# Altium schematic sheet logic_main.SchDoc: mcHF Pro Transceiver UI board
size A3; Author: Krassi Atanassov; CompanyName: MØNKA; Engineer: For radio amateurs experimentation, non-commercial use only. Thank you!; Revision: 0.8.2; SheetTotal: 18
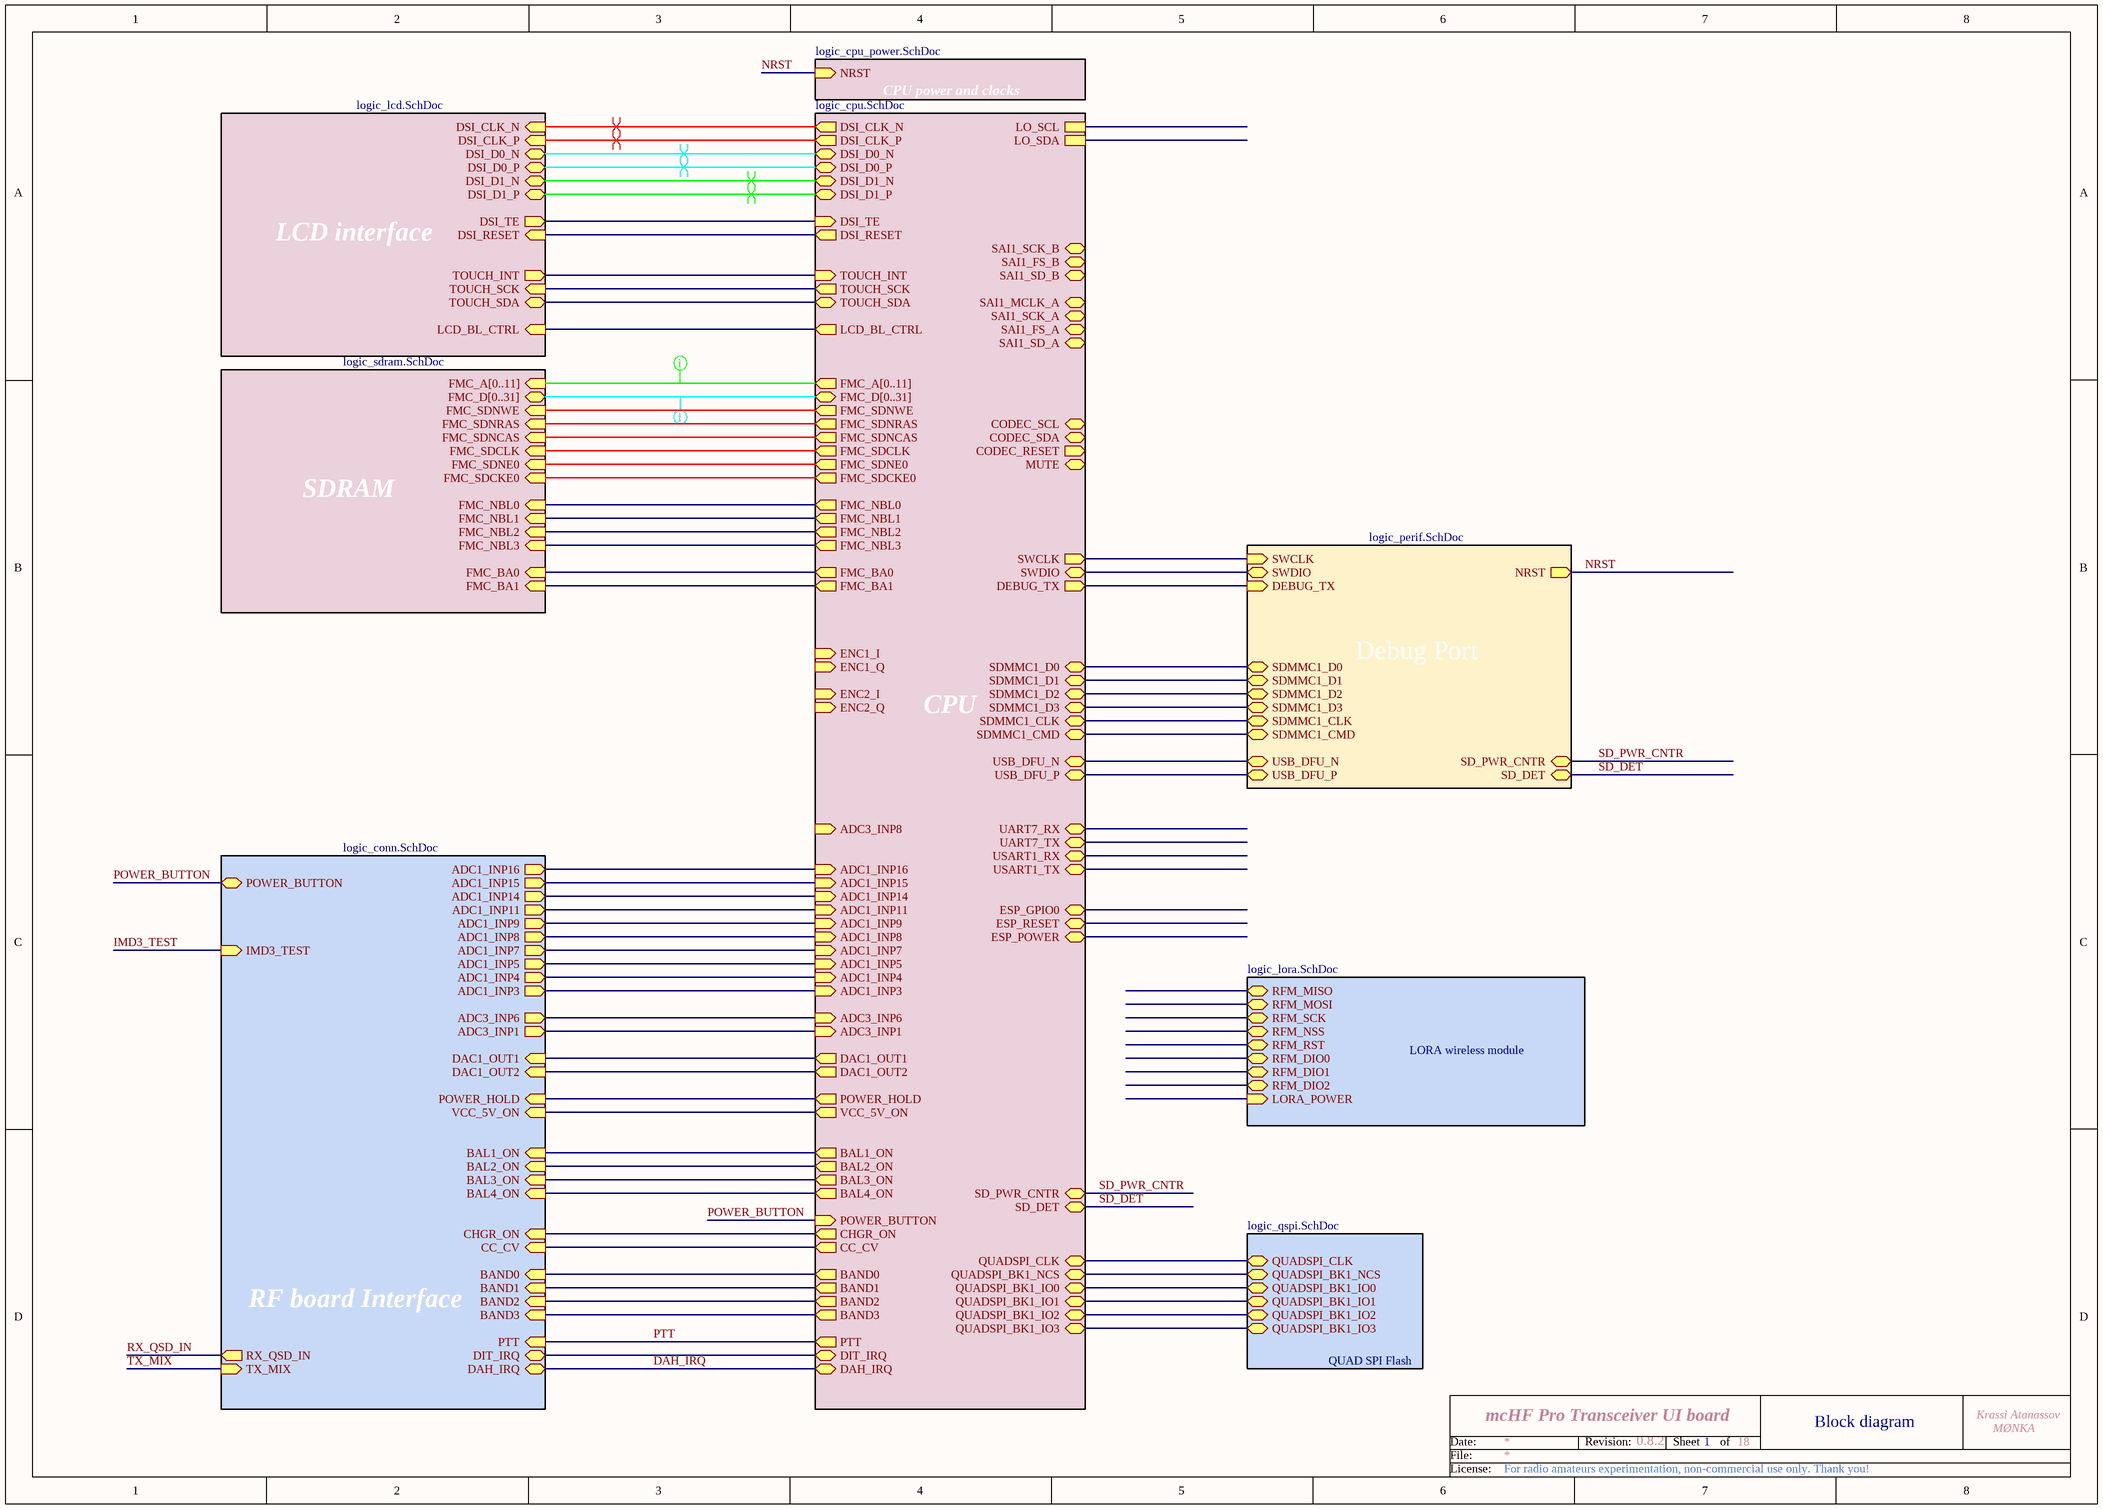
[diagram p0: logic_main.SchDoc]

## Sub-sheets
CPU = logic_cpu.SchDoc: FMC_A[0..11] (out), FMC_D[0..31] (bidir), FMC_SDNWE (out), FMC_SDNRAS (out), FMC_SDNCAS (out), FMC_SDCLK (out), FMC_BA0 (out), FMC_BA1 (out), FMC_SDNE0 (out), FMC_SDCKE0 (out), FMC_NBL0 (out), FMC_NBL1 (out), ENC1_I (in), ENC1_Q (in), ENC2_I (in), ENC2_Q (in), FMC_NBL2 (out), FMC_NBL3 (out), SWCLK (out), SWDIO (bidir), SDMMC1_D0 (bidir), SDMMC1_D1 (bidir), SDMMC1_D2 (bidir), SDMMC1_D3 (bidir), SDMMC1_CLK (bidir), SDMMC1_CMD (bidir), UART7_RX (bidir), UART7_TX (bidir), ESP_GPIO0 (bidir), ESP_RESET (bidir), ESP_POWER (bidir), DSI_CLK_N (out), DSI_CLK_P (out), DSI_D0_N (bidir), DSI_D0_P (bidir), DSI_D1_N (bidir), DSI_D1_P (bidir), LCD_BL_CTRL (out), TOUCH_INT (in), TOUCH_SCK (out), TOUCH_SDA (bidir), DSI_TE (in), DSI_RESET (out), LO_SCL, LO_SDA, ADC1_INP15 (in), ADC1_INP11 (in), ADC1_INP14 (in), ADC1_INP9 (in), ADC1_INP8 (in), ADC1_INP7 (in), ADC1_INP5 (in), ADC1_INP4 (in), ADC3_INP6 (in), ADC1_INP3 (in), ADC3_INP1 (in), POWER_HOLD (out), DAC1_OUT1 (out), DAC1_OUT2 (out), ADC1_INP16 (in), CODEC_SCL (bidir), CODEC_SDA (bidir), SAI1_SCK_B (bidir), SAI1_FS_B (bidir), SAI1_SD_B (bidir), SAI1_MCLK_A (bidir), SAI1_SCK_A (bidir), SAI1_FS_A (bidir), SAI1_SD_A (bidir), QUADSPI_CLK (bidir), QUADSPI_BK1_NCS (bidir), QUADSPI_BK1_IO0 (bidir), QUADSPI_BK1_IO1 (bidir), QUADSPI_BK1_IO3 (bidir), QUADSPI_BK1_IO2 (bidir), USART1_RX (bidir), USART1_TX (bidir), DEBUG_TX (out), VCC_5V_ON (out), BAL1_ON (out), BAL2_ON (out), BAL3_ON (out), BAND0 (out), BAND1 (out), BAND2 (out), BAND3 (out), PTT (out), DIT_IRQ (bidir), DAH_IRQ (bidir), ADC3_INP8 (in), USB_DFU_N (bidir), USB_DFU_P (bidir), CODEC_RESET (out), POWER_BUTTON (in), MUTE (bidir), BAL4_ON (out), CHGR_ON (out), CC_CV (out), SD_DET (bidir), SD_PWR_CNTR (bidir)
CPU power and clocks = logic_cpu_power.SchDoc: NRST (in)
Debug Port = logic_perif.SchDoc: SWCLK (in), SWDIO (bidir), NRST (out), SD_PWR_CNTR (bidir), SD_DET (bidir), DEBUG_TX (in), USB_DFU_N (bidir), USB_DFU_P (bidir), SDMMC1_D0 (bidir), SDMMC1_D1 (bidir), SDMMC1_D2 (bidir), SDMMC1_D3 (bidir), SDMMC1_CLK (bidir), SDMMC1_CMD (bidir)
LCD interface = logic_lcd.SchDoc: DSI_CLK_N (in), LCD_BL_CTRL (in), TOUCH_INT (out), TOUCH_SCK (in), TOUCH_SDA (bidir), DSI_CLK_P (in), DSI_D0_N (bidir), DSI_D0_P (bidir), DSI_D1_N (bidir), DSI_D1_P (bidir), DSI_TE (out), DSI_RESET (in)
LORA wireless module = logic_lora.SchDoc: RFM_MISO (bidir), RFM_MOSI (bidir), RFM_SCK (bidir), RFM_NSS (bidir), RFM_RST (bidir), RFM_DIO0 (bidir), LORA_POWER (in), RFM_DIO1 (bidir), RFM_DIO2 (bidir)
QUAD SPI Flash = logic_qspi.SchDoc: QUADSPI_CLK (bidir), QUADSPI_BK1_NCS (bidir), QUADSPI_BK1_IO0 (bidir), QUADSPI_BK1_IO1 (bidir), QUADSPI_BK1_IO3 (bidir), QUADSPI_BK1_IO2 (bidir)
RF board Interface = logic_conn.SchDoc: RX_QSD_IN (out), TX_MIX (in), ADC3_INP6 (out), ADC3_INP1 (out), POWER_HOLD (in), POWER_BUTTON (bidir), DAC1_OUT1 (in), DAC1_OUT2 (in), ADC1_INP15 (out), ADC1_INP11 (out), ADC1_INP14 (out), ADC1_INP9 (out), ADC1_INP8 (out), ADC1_INP7 (out), ADC1_INP5 (out), ADC1_INP4 (out), ADC1_INP3 (out), ADC1_INP16 (out), VCC_5V_ON (in), BAL1_ON (in), BAL2_ON (in), BAL3_ON (in), CHGR_ON (in), CC_CV (in), BAND0 (in), BAND1 (in), BAND2 (in), BAND3 (in), PTT (in), DIT_IRQ (bidir), DAH_IRQ (bidir), IMD3_TEST (in), BAL4_ON (in)
SDRAM = logic_sdram.SchDoc: FMC_A[0..11] (in), FMC_D[0..31] (bidir), FMC_SDNWE (in), FMC_SDNRAS (in), FMC_SDNCAS (in), FMC_SDCLK (in), FMC_BA0 (in), FMC_BA1 (in), FMC_NBL0 (in), FMC_NBL1 (in), FMC_SDNE0 (in), FMC_SDCKE0 (in), FMC_NBL2 (in), FMC_NBL3 (in)

## Nets
DAH_IRQ: sheet RF board Interface/DAH_IRQ, sheet CPU/DAH_IRQ
IMD3_TEST: sheet RF board Interface/IMD3_TEST
NRST: sheet CPU power and clocks/NRST, sheet Debug Port/NRST
POWER_BUTTON: sheet RF board Interface/POWER_BUTTON, sheet CPU/POWER_BUTTON
PTT: sheet RF board Interface/PTT, sheet CPU/PTT
RX_QSD_IN: sheet RF board Interface/RX_QSD_IN
SD_DET: sheet CPU/SD_DET, sheet Debug Port/SD_DET
SD_PWR_CNTR: sheet CPU/SD_PWR_CNTR, sheet Debug Port/SD_PWR_CNTR
TX_MIX: sheet RF board Interface/TX_MIX
(unnamed): sheet RF board Interface/ADC3_INP6, sheet CPU/ADC3_INP6
(unnamed): sheet RF board Interface/ADC3_INP1, sheet CPU/ADC3_INP1
(unnamed): sheet RF board Interface/POWER_HOLD, sheet CPU/POWER_HOLD
(unnamed): sheet RF board Interface/DAC1_OUT1, sheet CPU/DAC1_OUT1
(unnamed): sheet RF board Interface/DAC1_OUT2, sheet CPU/DAC1_OUT2
(unnamed): sheet RF board Interface/ADC1_INP15, sheet CPU/ADC1_INP15
(unnamed): sheet RF board Interface/ADC1_INP11, sheet CPU/ADC1_INP11
(unnamed): sheet RF board Interface/ADC1_INP14, sheet CPU/ADC1_INP14
(unnamed): sheet RF board Interface/ADC1_INP9, sheet CPU/ADC1_INP9
(unnamed): sheet RF board Interface/ADC1_INP8, sheet CPU/ADC1_INP8
(unnamed): sheet RF board Interface/ADC1_INP7, sheet CPU/ADC1_INP7
(unnamed): sheet RF board Interface/ADC1_INP5, sheet CPU/ADC1_INP5
(unnamed): sheet RF board Interface/ADC1_INP4, sheet CPU/ADC1_INP4
(unnamed): sheet RF board Interface/ADC1_INP3, sheet CPU/ADC1_INP3
(unnamed): sheet RF board Interface/ADC1_INP16, sheet CPU/ADC1_INP16
(unnamed): sheet RF board Interface/VCC_5V_ON, sheet CPU/VCC_5V_ON
(unnamed): sheet RF board Interface/BAL1_ON, sheet CPU/BAL1_ON
(unnamed): sheet RF board Interface/BAL2_ON, sheet CPU/BAL2_ON
(unnamed): sheet RF board Interface/BAL3_ON, sheet CPU/BAL3_ON
(unnamed): sheet RF board Interface/CHGR_ON, sheet CPU/CHGR_ON
(unnamed): sheet RF board Interface/CC_CV, sheet CPU/CC_CV
(unnamed): sheet RF board Interface/BAND0, sheet CPU/BAND0
(unnamed): sheet RF board Interface/BAND1, sheet CPU/BAND1
(unnamed): sheet RF board Interface/BAND2, sheet CPU/BAND2
(unnamed): sheet RF board Interface/BAND3, sheet CPU/BAND3
(unnamed): sheet RF board Interface/DIT_IRQ, sheet CPU/DIT_IRQ
(unnamed): sheet RF board Interface/BAL4_ON, sheet CPU/BAL4_ON
(unnamed): sheet CPU/FMC_SDNWE, sheet SDRAM/FMC_SDNWE
(unnamed): sheet CPU/FMC_SDNRAS, sheet SDRAM/FMC_SDNRAS
(unnamed): sheet CPU/FMC_SDNCAS, sheet SDRAM/FMC_SDNCAS
(unnamed): sheet CPU/FMC_SDCLK, sheet SDRAM/FMC_SDCLK
(unnamed): sheet CPU/FMC_BA0, sheet SDRAM/FMC_BA0
(unnamed): sheet CPU/FMC_BA1, sheet SDRAM/FMC_BA1
(unnamed): sheet CPU/FMC_SDNE0, sheet SDRAM/FMC_SDNE0
(unnamed): sheet CPU/FMC_SDCKE0, sheet SDRAM/FMC_SDCKE0
(unnamed): sheet CPU/FMC_NBL0, sheet SDRAM/FMC_NBL0
(unnamed): sheet CPU/FMC_NBL1, sheet SDRAM/FMC_NBL1
(unnamed): sheet CPU/FMC_NBL2, sheet SDRAM/FMC_NBL2
(unnamed): sheet CPU/FMC_NBL3, sheet SDRAM/FMC_NBL3
(unnamed): sheet CPU/SWCLK, sheet Debug Port/SWCLK
(unnamed): sheet CPU/SWDIO, sheet Debug Port/SWDIO
(unnamed): sheet CPU/SDMMC1_D0, sheet Debug Port/SDMMC1_D0
(unnamed): sheet CPU/SDMMC1_D1, sheet Debug Port/SDMMC1_D1
(unnamed): sheet CPU/SDMMC1_D2, sheet Debug Port/SDMMC1_D2
(unnamed): sheet CPU/SDMMC1_D3, sheet Debug Port/SDMMC1_D3
(unnamed): sheet CPU/SDMMC1_CLK, sheet Debug Port/SDMMC1_CLK
(unnamed): sheet CPU/SDMMC1_CMD, sheet Debug Port/SDMMC1_CMD
(unnamed): sheet CPU/DSI_CLK_N, sheet LCD interface/DSI_CLK_N
(unnamed): sheet CPU/DSI_CLK_P, sheet LCD interface/DSI_CLK_P
(unnamed): sheet CPU/DSI_D0_N, sheet LCD interface/DSI_D0_N
(unnamed): sheet CPU/DSI_D0_P, sheet LCD interface/DSI_D0_P
(unnamed): sheet CPU/DSI_D1_N, sheet LCD interface/DSI_D1_N
(unnamed): sheet CPU/DSI_D1_P, sheet LCD interface/DSI_D1_P
(unnamed): sheet CPU/LCD_BL_CTRL, sheet LCD interface/LCD_BL_CTRL
(unnamed): sheet CPU/TOUCH_INT, sheet LCD interface/TOUCH_INT
(unnamed): sheet CPU/TOUCH_SCK, sheet LCD interface/TOUCH_SCK
(unnamed): sheet CPU/TOUCH_SDA, sheet LCD interface/TOUCH_SDA
(unnamed): sheet CPU/DSI_TE, sheet LCD interface/DSI_TE
(unnamed): sheet CPU/DSI_RESET, sheet LCD interface/DSI_RESET
(unnamed): sheet CPU/QUADSPI_CLK, sheet QUAD SPI Flash/QUADSPI_CLK
(unnamed): sheet CPU/QUADSPI_BK1_NCS, sheet QUAD SPI Flash/QUADSPI_BK1_NCS
(unnamed): sheet CPU/QUADSPI_BK1_IO0, sheet QUAD SPI Flash/QUADSPI_BK1_IO0
(unnamed): sheet CPU/QUADSPI_BK1_IO1, sheet QUAD SPI Flash/QUADSPI_BK1_IO1
(unnamed): sheet CPU/QUADSPI_BK1_IO3, sheet QUAD SPI Flash/QUADSPI_BK1_IO3
(unnamed): sheet CPU/QUADSPI_BK1_IO2, sheet QUAD SPI Flash/QUADSPI_BK1_IO2
(unnamed): sheet CPU/DEBUG_TX, sheet Debug Port/DEBUG_TX
(unnamed): sheet CPU/USB_DFU_N, sheet Debug Port/USB_DFU_N
(unnamed): sheet CPU/USB_DFU_P, sheet Debug Port/USB_DFU_P

## Buses and harness runs
bus sheet CPU/FMC_A[0..11] = sheet SDRAM/FMC_A[0..11]
bus sheet CPU/FMC_D[0..31] = sheet SDRAM/FMC_D[0..31]

## Layout directives
differential pair: (no net found under the mark)
rule Matched Net Lengths [Tolerance = 100mil]: (no net found under the mark)

## Notes on the sheet
- 1
- Block diagram
- Date:
- File:
- Revision:
- Sheet
- of
- License: